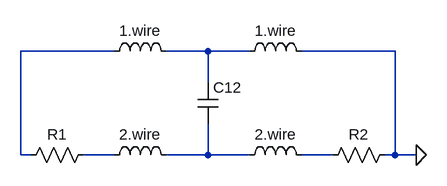
[diagram p0: schematic sch_H.asc]
sch_H.asc, the LTspice schematic file:
Version 4
SHEET 1 880 680
WIRE -144 0 -288 0
WIRE 0 0 -64 0
WIRE 64 0 0 0
WIRE 288 0 144 0
WIRE 0 48 0 0
WIRE -288 160 -288 0
WIRE -272 160 -288 160
WIRE -144 160 -192 160
WIRE 0 160 0 112
WIRE 0 160 -64 160
WIRE 64 160 0 160
WIRE 192 160 144 160
WIRE 288 160 288 0
WIRE 288 160 272 160
WIRE 320 160 288 160
FLAG 320 160 0
SYMBOL cap -16 48 R0
SYMATTR InstName C12
SYMATTR Value ""
SYMBOL ind -160 16 R270
WINDOW 0 32 56 VTop 2
WINDOW 3 5 56 VBottom 2
SYMATTR InstName 1.wire
SYMATTR Value ""
SYMBOL res -176 144 R90
WINDOW 0 0 56 VBottom 2
WINDOW 3 32 56 VTop 2
SYMATTR InstName R1
SYMATTR Value ""
SYMBOL ind 48 16 R270
WINDOW 0 32 56 VTop 2
WINDOW 3 5 56 VBottom 2
SYMATTR InstName 1.wire
SYMATTR Value ""
SYMBOL ind -160 176 R270
WINDOW 0 32 56 VTop 2
WINDOW 3 5 56 VBottom 2
SYMATTR InstName 2.wire
SYMATTR Value ""
SYMBOL ind 48 176 R270
WINDOW 0 32 56 VTop 2
WINDOW 3 5 56 VBottom 2
SYMATTR InstName 2.wire
SYMATTR Value ""
SYMBOL res 288 144 R90
WINDOW 0 0 56 VBottom 2
WINDOW 3 32 56 VTop 2
SYMATTR InstName R2
SYMATTR Value ""

The netlist it stands for:
* sch_H.asc
C12 N002 N004
L§1.wire N001 N002
R1 N003 N001
L§1.wire N002 0
L§2.wire N003 N004
L§2.wire N004 N005
R2 0 N005
.backanno
.end